# Altium project Omnifly-H7.PrjPcb (part 1 of 2)
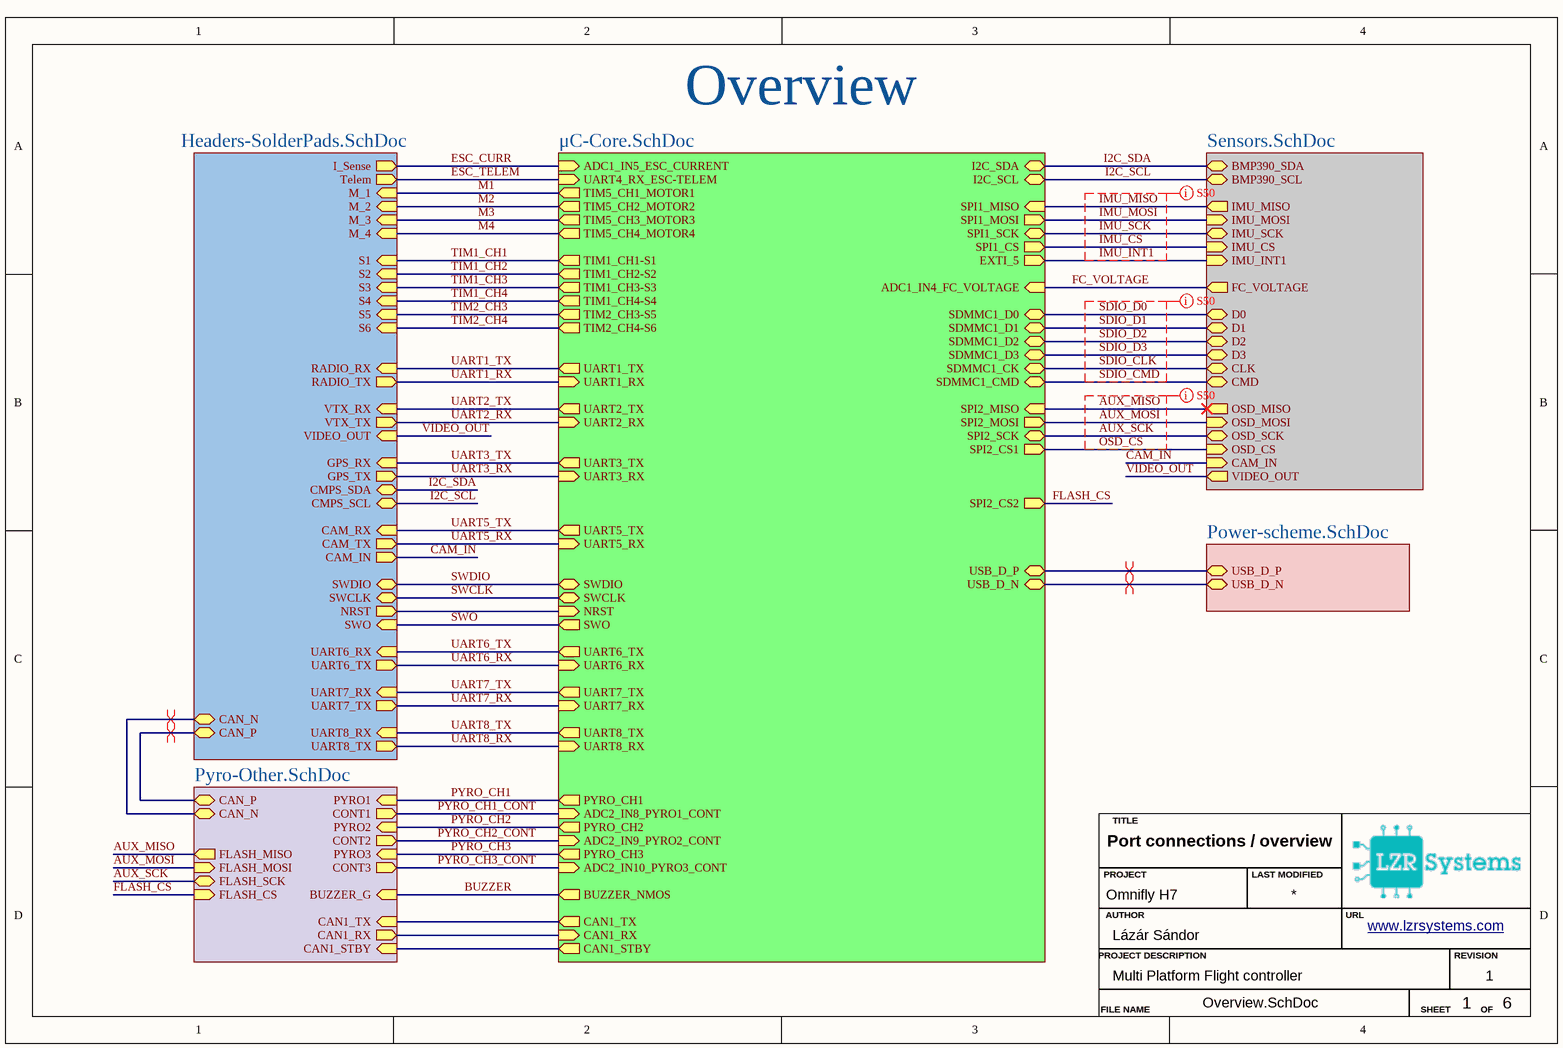
[diagram p0: Overview.SchDoc]
G.Author: Lázár Sándor; G.Description: Multi Platform Flight controller; G.Project: Omnifly H7; G.Revision: 1; G.URL: www.lzrsystems.com
6 sheets, 175 parts. Net scope: hierarchical (ports join the sheet entries above them; power ports are global).
Board file: PCB1.PcbDoc
Sheets:
  Overview.SchDoc
    U_μC-Core = μC-Core.SchDoc
    U_Headers-SolderPads = Headers-SolderPads.SchDoc
    U_Sensors = Sensors.SchDoc
    U_Pyro-Other = Pyro-Other.SchDoc
    U_Power-scheme = Power-scheme.SchDoc

## Sheet Overview.SchDoc: Port connections / overview
size A4; SheetNumber: 1; SheetTotal: 6

### Sub-sheets
U_Headers-SolderPads = Headers-SolderPads.SchDoc: I_Sense (out), M_2 (in), M_3 (in), M_4 (in), Telem (out), M_1 (in), S1 (in), S2 (in), S3 (in), S4 (in), S5 (in), S6 (in), GPS_TX (out), CMPS_SDA (bidir), CMPS_SCL (bidir), CAM_RX (in), CAM_TX (out), CAM_IN (out), SWDIO (bidir), SWCLK (bidir), SWO (in), GPS_RX (in), RADIO_TX (out), RADIO_RX (in), VTX_TX (out), VTX_RX (in), VIDEO_OUT (in), NRST (out), UART6_TX (out), UART6_RX (in), UART7_TX (out), UART7_RX (in), UART8_TX (out), UART8_RX (in), CAN_P (bidir), CAN_N (bidir)
U_Power-scheme = Power-scheme.SchDoc: USB_D_P (bidir), USB_D_N (bidir)
U_Pyro-Other = Pyro-Other.SchDoc: PYRO1 (in), CONT1 (out), PYRO2 (in), PYRO3 (in), CONT2 (out), CONT3 (out), BUZZER_G (in), CAN1_RX (out), CAN1_TX (in), CAN1_STBY (in), CAN_P (bidir), CAN_N (bidir), FLASH_MISO (out), FLASH_MOSI (in), FLASH_SCK (bidir), FLASH_CS (in)
U_Sensors = Sensors.SchDoc: BMP390_SCL (bidir), BMP390_SDA (bidir), IMU_CS (in), IMU_INT1 (in), IMU_SCK (bidir), IMU_MISO (out), IMU_MOSI (in), FC_VOLTAGE (out), D3 (bidir), D2 (bidir), CMD (bidir), CLK (bidir), D0 (bidir), D1 (bidir), OSD_CS (in), OSD_MOSI (in), OSD_MISO (out), OSD_SCK (bidir), VIDEO_OUT (out), CAM_IN (in)
U_μC-Core = μC-Core.SchDoc: SWDIO (bidir), SWCLK (bidir), SWO (out), SPI1_CS (out), SPI1_SCK (bidir), SPI1_MISO (in), SPI1_MOSI (out), SPI2_SCK (bidir), SPI2_MOSI (out), SPI2_MISO (in), SDMMC1_CMD (bidir), SDMMC1_CK (bidir), SDMMC1_D3 (bidir), SDMMC1_D2 (bidir), SDMMC1_D1 (bidir), SDMMC1_D0 (bidir), PYRO_CH3 (out), PYRO_CH2 (out), PYRO_CH1 (out), ADC1_IN4_FC_VOLTAGE (in), ADC1_IN5_ESC_CURRENT (in), TIM5_CH1_MOTOR1 (out), TIM5_CH2_MOTOR2 (out), TIM5_CH3_MOTOR3 (out), TIM5_CH4_MOTOR4 (out), UART4_RX_ESC-TELEM (in), BUZZER_NMOS (out), USB_D_P (bidir), USB_D_N (bidir), UART1_TX (out), UART1_RX (in), UART2_TX (out), UART2_RX (in), UART3_TX (out), UART3_RX (in), UART5_TX (out), UART5_RX (in), UART6_TX (out), UART6_RX (in), UART7_TX (out), UART7_RX (in), UART8_TX (out), UART8_RX (in), TIM2_CH3-S5 (out), TIM2_CH4-S6 (out), TIM1_CH1-S1 (out), TIM1_CH2-S2 (out), TIM1_CH3-S3 (out), TIM1_CH4-S4 (out), I2C_SCL (bidir), I2C_SDA (bidir), EXTI_5 (out), NRST (in), ADC2_IN8_PYRO1_CONT (in), ADC2_IN9_PYRO2_CONT (in), ADC2_IN10_PYRO3_CONT (in), CAN1_STBY (out), CAN1_RX (in), CAN1_TX (out), SPI2_CS1 (out), SPI2_CS2 (out)

### Nets
AUX_MISO: sheet U_μC-Core/SPI2_MISO, sheet U_Sensors/OSD_MISO, sheet U_Pyro-Other/FLASH_MISO
AUX_MOSI: sheet U_μC-Core/SPI2_MOSI, sheet U_Sensors/OSD_MOSI, sheet U_Pyro-Other/FLASH_MOSI
AUX_SCK: sheet U_μC-Core/SPI2_SCK, sheet U_Sensors/OSD_SCK, sheet U_Pyro-Other/FLASH_SCK
BUZZER: sheet U_μC-Core/BUZZER_NMOS, sheet U_Pyro-Other/BUZZER_G
CAM_IN: sheet U_Headers-SolderPads/CAM_IN, sheet U_Sensors/CAM_IN
CAN_N: sheet U_Headers-SolderPads/CAN_N, sheet U_Pyro-Other/CAN_N
CAN_P: sheet U_Headers-SolderPads/CAN_P, sheet U_Pyro-Other/CAN_P
ESC_CURR: sheet U_μC-Core/ADC1_IN5_ESC_CURRENT, sheet U_Headers-SolderPads/I_Sense
ESC_TELEM: sheet U_μC-Core/UART4_RX_ESC-TELEM, sheet U_Headers-SolderPads/Telem
FC_VOLTAGE: sheet U_μC-Core/ADC1_IN4_FC_VOLTAGE, sheet U_Sensors/FC_VOLTAGE
FLASH_CS: sheet U_μC-Core/SPI2_CS2, sheet U_Pyro-Other/FLASH_CS
I2C_SCL: sheet U_μC-Core/I2C_SCL, sheet U_Headers-SolderPads/CMPS_SCL, sheet U_Sensors/BMP390_SCL
I2C_SDA: sheet U_μC-Core/I2C_SDA, sheet U_Headers-SolderPads/CMPS_SDA, sheet U_Sensors/BMP390_SDA
IMU_CS: sheet U_μC-Core/SPI1_CS, sheet U_Sensors/IMU_CS
IMU_INT1: sheet U_μC-Core/EXTI_5, sheet U_Sensors/IMU_INT1
IMU_MISO: sheet U_μC-Core/SPI1_MISO, sheet U_Sensors/IMU_MISO
IMU_MOSI: sheet U_μC-Core/SPI1_MOSI, sheet U_Sensors/IMU_MOSI
IMU_SCK: sheet U_μC-Core/SPI1_SCK, sheet U_Sensors/IMU_SCK
M1: sheet U_μC-Core/TIM5_CH1_MOTOR1, sheet U_Headers-SolderPads/M_1
M2: sheet U_μC-Core/TIM5_CH2_MOTOR2, sheet U_Headers-SolderPads/M_2
M3: sheet U_μC-Core/TIM5_CH3_MOTOR3, sheet U_Headers-SolderPads/M_3
M4: sheet U_μC-Core/TIM5_CH4_MOTOR4, sheet U_Headers-SolderPads/M_4
NRST: sheet U_μC-Core/NRST, sheet U_Headers-SolderPads/NRST
OSD_CS: sheet U_μC-Core/SPI2_CS1, sheet U_Sensors/OSD_CS
PYRO_CH1: sheet U_μC-Core/PYRO_CH1, sheet U_Pyro-Other/PYRO1
PYRO_CH1_CONT: sheet U_μC-Core/ADC2_IN8_PYRO1_CONT, sheet U_Pyro-Other/CONT1
PYRO_CH2: sheet U_μC-Core/PYRO_CH2, sheet U_Pyro-Other/PYRO2
PYRO_CH2_CONT: sheet U_μC-Core/ADC2_IN9_PYRO2_CONT, sheet U_Pyro-Other/CONT2
PYRO_CH3: sheet U_μC-Core/PYRO_CH3, sheet U_Pyro-Other/PYRO3
PYRO_CH3_CONT: sheet U_μC-Core/ADC2_IN10_PYRO3_CONT, sheet U_Pyro-Other/CONT3
SDIO_CLK: sheet U_μC-Core/SDMMC1_CK, sheet U_Sensors/CLK
SDIO_CMD: sheet U_μC-Core/SDMMC1_CMD, sheet U_Sensors/CMD
SDIO_D0: sheet U_μC-Core/SDMMC1_D0, sheet U_Sensors/D0
SDIO_D1: sheet U_μC-Core/SDMMC1_D1, sheet U_Sensors/D1
SDIO_D2: sheet U_μC-Core/SDMMC1_D2, sheet U_Sensors/D2
SDIO_D3: sheet U_μC-Core/SDMMC1_D3, sheet U_Sensors/D3
SWCLK: sheet U_μC-Core/SWCLK, sheet U_Headers-SolderPads/SWCLK
SWDIO: sheet U_μC-Core/SWDIO, sheet U_Headers-SolderPads/SWDIO
SWO: sheet U_μC-Core/SWO, sheet U_Headers-SolderPads/SWO
TIM1_CH1: sheet U_μC-Core/TIM1_CH1-S1, sheet U_Headers-SolderPads/S1
TIM1_CH2: sheet U_μC-Core/TIM1_CH2-S2, sheet U_Headers-SolderPads/S2
TIM1_CH3: sheet U_μC-Core/TIM1_CH3-S3, sheet U_Headers-SolderPads/S3
TIM1_CH4: sheet U_μC-Core/TIM1_CH4-S4, sheet U_Headers-SolderPads/S4
TIM2_CH3: sheet U_μC-Core/TIM2_CH3-S5, sheet U_Headers-SolderPads/S5
TIM2_CH4: sheet U_μC-Core/TIM2_CH4-S6, sheet U_Headers-SolderPads/S6
UART1_RX: sheet U_μC-Core/UART1_RX, sheet U_Headers-SolderPads/RADIO_TX
UART1_TX: sheet U_μC-Core/UART1_TX, sheet U_Headers-SolderPads/RADIO_RX
UART2_RX: sheet U_μC-Core/UART2_RX, sheet U_Headers-SolderPads/VTX_TX
UART2_TX: sheet U_μC-Core/UART2_TX, sheet U_Headers-SolderPads/VTX_RX
UART3_RX: sheet U_μC-Core/UART3_RX, sheet U_Headers-SolderPads/GPS_TX
UART3_TX: sheet U_μC-Core/UART3_TX, sheet U_Headers-SolderPads/GPS_RX
UART5_RX: sheet U_μC-Core/UART5_RX, sheet U_Headers-SolderPads/CAM_TX
UART5_TX: sheet U_μC-Core/UART5_TX, sheet U_Headers-SolderPads/CAM_RX
UART6_RX: sheet U_μC-Core/UART6_RX, sheet U_Headers-SolderPads/UART6_TX
UART6_TX: sheet U_μC-Core/UART6_TX, sheet U_Headers-SolderPads/UART6_RX
UART7_RX: sheet U_μC-Core/UART7_RX, sheet U_Headers-SolderPads/UART7_TX
UART7_TX: sheet U_μC-Core/UART7_TX, sheet U_Headers-SolderPads/UART7_RX
UART8_RX: sheet U_μC-Core/UART8_RX, sheet U_Headers-SolderPads/UART8_TX
UART8_TX: sheet U_μC-Core/UART8_TX, sheet U_Headers-SolderPads/UART8_RX
USB_D_N: sheet U_μC-Core/USB_D_N, sheet U_Power-scheme/USB_D_N
USB_D_P: sheet U_μC-Core/USB_D_P, sheet U_Power-scheme/USB_D_P
VIDEO_OUT: sheet U_Headers-SolderPads/VIDEO_OUT, sheet U_Sensors/VIDEO_OUT
NetU3_1: sheet U_μC-Core/CAN1_STBY, sheet U_Pyro-Other/CAN1_STBY
NetU3_95: sheet U_μC-Core/CAN1_RX, sheet U_Pyro-Other/CAN1_RX
NetU3_96: sheet U_μC-Core/CAN1_TX, sheet U_Pyro-Other/CAN1_TX

### Layout directives
differential pair: CAN_N, CAN_P, USB_D_N, USB_D_P
net class S50: AUX_MISO, AUX_MOSI, AUX_SCK, IMU_CS, IMU_INT1, IMU_MISO, IMU_MOSI, IMU_SCK, OSD_CS, SDIO_CLK, SDIO_CMD, SDIO_D0, SDIO_D1, SDIO_D2, SDIO_D3

### Notes on the sheet
- Overview
- TITLE
- AUTHOR
- PROJECT
- LAST MODIFIED
- URL
- PROJECT DESCRIPTION
- REVISION
- FILE NAME
- SHEET
- OF

## Sheet μC-Core.SchDoc: Microcontroller & Pinout
size A4; Author: Lázár Sándor; SheetNumber: 3; SheetTotal: 6; URL: lzrsystems.com
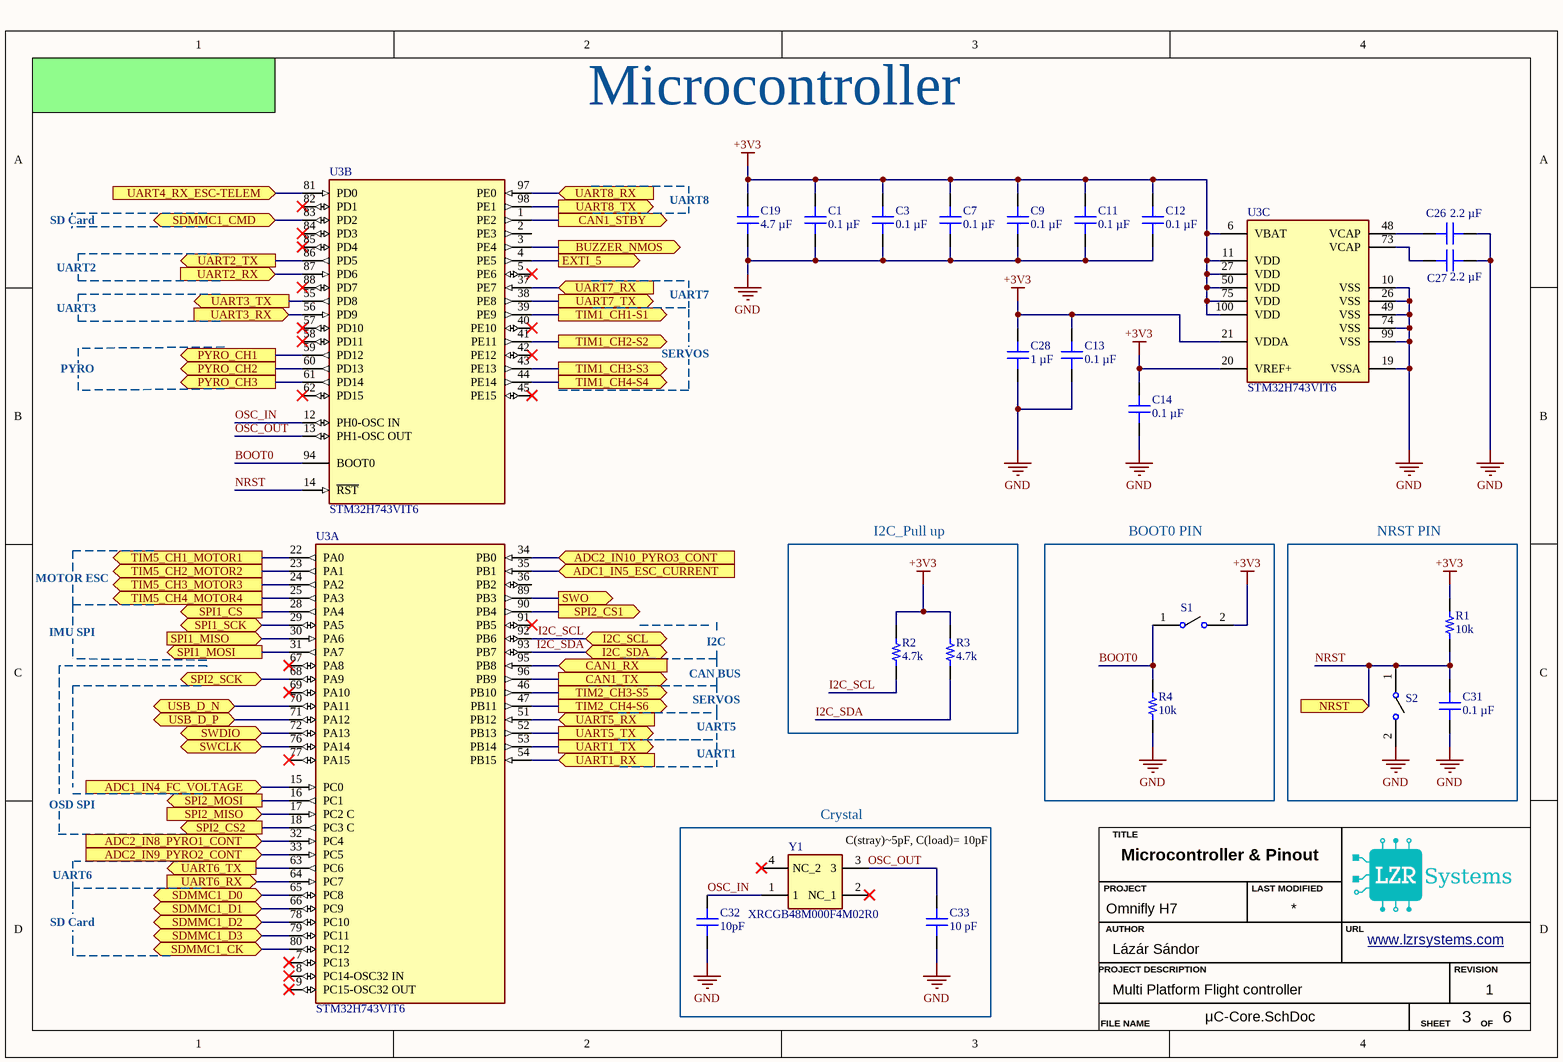
[diagram p1: μC-Core.SchDoc]

### Parts
C1  0.1 µF  [MURATA GCM155 0402_1005]
C3  0.1 µF  [MURATA GCM155 0402_1005]
C7  0.1 µF  [MURATA GCM155 0402_1005]
C9  0.1 µF  [MURATA GCM155 0402_1005]
C11  0.1 µF  [MURATA GCM155 0402_1005]
C12  0.1 µF  [MURATA GCM155 0402_1005]
C13  0.1 µF  [MURATA GCM155 0402_1005]
C14  0.1 µF  [MURATA GCM155 0402_1005]
C19  4.7 µF  [MURATA GRM21B 0805_2012]
C26  2.2 µF  [CAP 0805_2012]
C27  2.2 µF  [CAP 0805_2012]
C28  1 µF  [CAP 0805_2012]
C31  0.1 µF  [MURATA GCM155 0402_1005]
C32  Capacitance: 10pF  [CAP 0402_1005]  (hidden comment: 10 pF)
C33  10 pF  [CAP 0402_1005]
R1  10k  [YAGEO RES 0402_1005]
R2  4.7k  [YAGEO RES 0402_1005]
R3  4.7k  [YAGEO RES 0402_1005]
R4  10k  [YAGEO RES 0402_1005]
S1  TS09-63-25-WT-160-SMT-TR  [TS096325WT160SMTTR]  (value not drawn)
S2  TS09-63-25-WT-160-SMT-TR  [TS096325WT160SMTTR]  (value not drawn)
U3  STM32H743VIT6  [FP-LQFP100-1L-IPC_C]  (parts A,B,C of 3)
Y1  XRCGB48M000F4M02R0  [XRCGB]

### Blocks framed on the sheet
I2C_Pull up: R2 R3
BOOT0 PIN: R4 S1
NRST PIN: C31 R1 S2
Crystal: C32 C33 Y1

### Ports
ADC1_IN4_FC_VOLTAGE (in), ADC1_IN5_ESC_CURRENT (in), ADC2_IN8_PYRO1_CONT (in), ADC2_IN9_PYRO2_CONT (in), ADC2_IN10_PYRO3_CONT (in), BUZZER_NMOS (out), CAN1_RX (in), CAN1_STBY (out), CAN1_TX (out), EXTI_5 (out), I2C_SCL (bidir), I2C_SDA (bidir), NRST (in), PYRO_CH1 (out), PYRO_CH2 (out), PYRO_CH3 (out), SDMMC1_CK (bidir), SDMMC1_CMD (bidir), SDMMC1_D0 (bidir), SDMMC1_D1 (bidir), SDMMC1_D2 (bidir), SDMMC1_D3 (bidir), SPI1_CS (out), SPI1_MISO (in), SPI1_MOSI (out), SPI1_SCK (bidir), SPI2_CS1 (out), SPI2_CS2 (out), SPI2_MISO (in), SPI2_MOSI (out), SPI2_SCK (bidir), SWCLK (bidir), SWDIO (bidir), SWO (out), TIM1_CH1-S1 (out), TIM1_CH2-S2 (out), TIM1_CH3-S3 (out), TIM1_CH4-S4 (out), TIM2_CH3-S5 (out), TIM2_CH4-S6 (out), TIM5_CH1_MOTOR1 (out), TIM5_CH2_MOTOR2 (out), TIM5_CH3_MOTOR3 (out), TIM5_CH4_MOTOR4 (out), UART1_RX (in), UART1_TX (out), UART2_RX (in), UART2_TX (out), UART3_RX (in), UART3_TX (out), UART4_RX_ESC-TELEM (in), UART5_RX (in), UART5_TX (out), UART6_RX (in), UART6_TX (out), UART7_RX (in), UART7_TX (out), UART8_RX (in), UART8_TX (out), USB_D_N (bidir), USB_D_P (bidir)

### Nets
+3V3: C1.2 C3.2 C7.2 C9.2 C11.2 C12.2 C13.2 C14.2 C19.2 C28.2 R1.1 R2.2 R3.2 S1.2(NO) U3.6(VBAT) U3.11(VDD) U3.20(VREF+) U3.21(VDDA) U3.27(VDD) U3.50(VDD) U3.75(VDD) U3.100(VDD)
GND: C1.1 C3.1 C7.1 C9.1 C11.1 C12.1 C13.1 C14.1 C19.1 C26.2 C27.1 C28.1 C31.1 C32.1 C33.1 R4.2 S2.2(NO) U3.10(VSS) U3.19(VSSA) U3.26(VSS) U3.49(VSS) U3.74(VSS) U3.99(VSS)
AUX_MISO: U3.17(PC2_C) ; port SPI2_MISO
AUX_MOSI: U3.16(PC1) ; port SPI2_MOSI
AUX_SCK: U3.68(PA9) ; port SPI2_SCK
BOOT0: R4.1 S1.1(COM) U3.94(BOOT0)
BUZZER: U3.3(PE4) ; port BUZZER_NMOS
ESC_CURR: U3.35(PB1) ; port ADC1_IN5_ESC_CURRENT
ESC_TELEM: U3.81(PD0) ; port UART4_RX_ESC-TELEM
FC_VOLTAGE: U3.15(PC0) ; port ADC1_IN4_FC_VOLTAGE
FLASH_CS: U3.18(PC3_C) ; port SPI2_CS2
I2C_SCL: R2.1 U3.92(PB6) ; port I2C_SCL
I2C_SDA: R3.1 U3.93(PB7) ; port I2C_SDA
IMU_CS: U3.28(PA4) ; port SPI1_CS
IMU_INT1: U3.4(PE5) ; port EXTI_5
IMU_MISO: U3.30(PA6) ; port SPI1_MISO
IMU_MOSI: U3.31(PA7) ; port SPI1_MOSI
IMU_SCK: U3.29(PA5) ; port SPI1_SCK
M1: U3.22(PA0) ; port TIM5_CH1_MOTOR1
M2: U3.23(PA1) ; port TIM5_CH2_MOTOR2
M3: U3.24(PA2) ; port TIM5_CH3_MOTOR3
M4: U3.25(PA3) ; port TIM5_CH4_MOTOR4
NRST: C31.2 R1.2 S2.1(COM) U3.14(~{RST}) ; port NRST
OSC_IN: C32.2 U3.12(PH0-OSC_IN) Y1.1
OSC_OUT: C33.2 U3.13(PH1-OSC_OUT) Y1.3
OSD_CS: U3.90(PB4) ; port SPI2_CS1
PYRO_CH1: U3.59(PD12) ; port PYRO_CH1
PYRO_CH1_CONT: U3.32(PC4) ; port ADC2_IN8_PYRO1_CONT
PYRO_CH2: U3.60(PD13) ; port PYRO_CH2
PYRO_CH2_CONT: U3.33(PC5) ; port ADC2_IN9_PYRO2_CONT
PYRO_CH3: U3.61(PD14) ; port PYRO_CH3
PYRO_CH3_CONT: U3.34(PB0) ; port ADC2_IN10_PYRO3_CONT
SDIO_CLK: U3.80(PC12) ; port SDMMC1_CK
SDIO_CMD: U3.83(PD2) ; port SDMMC1_CMD
SDIO_D0: U3.65(PC8) ; port SDMMC1_D0
SDIO_D1: U3.66(PC9) ; port SDMMC1_D1
SDIO_D2: U3.78(PC10) ; port SDMMC1_D2
SDIO_D3: U3.79(PC11) ; port SDMMC1_D3
SWCLK: U3.76(PA14) ; port SWCLK
SWDIO: U3.72(PA13) ; port SWDIO
SWO: U3.89(PB3) ; port SWO
TIM1_CH1: U3.39(PE9) ; port TIM1_CH1-S1
TIM1_CH2: U3.41(PE11) ; port TIM1_CH2-S2
TIM1_CH3: U3.43(PE13) ; port TIM1_CH3-S3
TIM1_CH4: U3.44(PE14) ; port TIM1_CH4-S4
TIM2_CH3: U3.46(PB10) ; port TIM2_CH3-S5
TIM2_CH4: U3.47(PB11) ; port TIM2_CH4-S6
UART1_RX: U3.54(PB15) ; port UART1_RX
UART1_TX: U3.53(PB14) ; port UART1_TX
UART2_RX: U3.87(PD6) ; port UART2_RX
UART2_TX: U3.86(PD5) ; port UART2_TX
UART3_RX: U3.56(PD9) ; port UART3_RX
UART3_TX: U3.55(PD8) ; port UART3_TX
UART5_RX: U3.51(PB12) ; port UART5_RX
UART5_TX: U3.52(PB13) ; port UART5_TX
UART6_RX: U3.64(PC7) ; port UART6_RX
UART6_TX: U3.63(PC6) ; port UART6_TX
UART7_RX: U3.37(PE7) ; port UART7_RX
UART7_TX: U3.38(PE8) ; port UART7_TX
UART8_RX: U3.97(PE0) ; port UART8_RX
UART8_TX: U3.98(PE1) ; port UART8_TX
USB_D_N: U3.70(PA11) ; port USB_D_N
USB_D_P: U3.71(PA12) ; port USB_D_P
NetC26_1: C26.1 U3.48(VCAP)
NetC27_2: C27.2 U3.73(VCAP)
NetU3_1: U3.1(PE2) ; port CAN1_STBY
NetU3_95: U3.95(PB8) ; port CAN1_RX
NetU3_96: U3.96(PB9) ; port CAN1_TX

Not connected (* = marked no-connect by the designer): U3 2(PE3) 5(PE6)* 7(PC13)* 8(PC14-OSC32_IN)* 9(PC15-OSC32_OUT)* 36(PB2) 40(PE10)* 42(PE12)* 45(PE15)* 57(PD10)* 58(PD11)* 62(PD15)* 67(PA8)* 69(PA10)* 77(PA15)* 82(PD1)* 84(PD3)* 85(PD4)* 88(PD7)* 91(PB5)*; Y1 2(NC_1)* 4(NC_2)*

### Notes on the sheet
- Microcontroller
- (near C19) UART8
- SD Card
- UART2
- UART3
- UART7
- PYRO
- SERVOS
- MOTOR ESC
- IMU SPI
- CAN BUS
- I2C
- UART5
- OSD SPI
- UART1
- UART6
- (near Y1) C(stray)~5pF, C(load)= 10pF
- TITLE
- AUTHOR
- PROJECT
- LAST MODIFIED
- URL
- PROJECT DESCRIPTION
- REVISION
- FILE NAME
- SHEET
- OF

### Library data of the parts
C1 C3 C7 C9 C11-C14 C31 = GCM155R71H104ME02D: CAP CER 0.1UF 50V X7R 0402; manufacturer: Murata Electronics; Tolerance: ±20%; Part Number: GCM155R71H104ME02D; Capacitance: 0.1 µF; Applications: Automotive; componentlink1description: Datasheet; componentlink1url: https://psearch.en.murata.com/capacitor/product/GCM155R71H104ME02%23.pdf; componentlink2description: DigiKey Link; componentlink2url: https://www.digikey.com/en/products/detail/murata-electronics/GCM155R71H104ME02D/9867913; Device Package: 0402 (1005 Metric); lastupdated: 7/20/2024 2:04:19 AM; Lifecycle Status: Active; Minimum Order: 1; Mounting Type: Surface Mount, MLCC; Operating Temperature: -55°C ~ 125°C; Package / Case: 0402 (1005 Metric); packaging: TapeAndReel; partid: 39038; Part Status: Active; price: 0.01; Ratings: AEC-Q200; series: GCM; Size / Dimension: 0.039" L x 0.020" W (1.00mm x 0.50mm); Supplier 1: DigiKey; Supplier Part Number 1: 490-18204-1-ND; Temperature Coefficient: X7R; Thickness (Max): 0.022" (0.55mm); value: 0.1 µF; Voltage - Rated: 50V
C19 = GRM21BR61H475KE51L: CAP CER 4.7UF 50V X5R 0805; manufacturer: Murata Electronics; Tolerance: ±10%; Part Number: GRM21BR61H475KE51L; Capacitance: 4.7 µF; Applications: General Purpose; componentlink1description: Datasheet; componentlink1url: https://search.murata.co.jp/Ceramy/image/img/A01X/G101/ENG/GRM21BR61H475KE51-01.pdf; componentlink2description: DigiKey Link; componentlink2url: https://www.digikey.com/en/products/detail/murata-electronics/GRM21BR61H475KE51L/4905540; Device Package: 0805 (2012 Metric); lastupdated: 8/27/2024 9:29:55 AM; Lifecycle Status: Active; Minimum Order: 1; Mounting Type: Surface Mount, MLCC; Operating Temperature: -55°C ~ 85°C; Package / Case: 0805 (2012 Metric); packaging: TapeAndReel; partid: 15077; Part Status: Active; price: 0.03; series: GRM; Size / Dimension: 0.079" L x 0.049" W (2.00mm x 1.25mm); Supplier 1: DigiKey; Supplier Part Number 1: 490-10751-1-ND; Temperature Coefficient: X5R; Thickness (Max): 0.055" (1.40mm); value: 4.7 µF; Voltage - Rated: 50V
C26 C27 = GCM21BL8EG225KE07L: CAP CER 2.2UF 35V X8L 0805; manufacturer: Murata Electronics; Tolerance: ±10%; Part Number: GCM21BL8EG225KE07L; Capacitance: 2.2 µF; Applications: Automotive; componentlink2description: DigiKey Link; componentlink2url: https://www.digikey.com/en/products/detail/murata-electronics/GCM21BL8EG225KE07L/10700975; Device Package: 0805 (2012 Metric); lastupdated: 2/9/2024 8:15:05 PM; Lifecycle Status: Active; Minimum Order: 1; Mounting Type: Surface Mount, MLCC; Operating Temperature: -55°C ~ 150°C; Package / Case: 0805 (2012 Metric); packaging: TapeAndReel; partid: 40665; Part Status: Active; price: 0.10; Ratings: AEC-Q200; series: GCM; Size / Dimension: 0.079" L x 0.049" W (2.00mm x 1.25mm); Supplier 1: DigiKey; Supplier Part Number 1: 490-GCM21BL8EG225KE07LCT-ND; Temperature Coefficient: X8L; Thickness (Max): 0.055" (1.40mm); value: 2.2 µF; Voltage - Rated: 35V
C28 = GRM219R7YA105MA12D: CAP CER 1UF 35V X7R 0805; manufacturer: Murata Electronics; Tolerance: ±20%; Part Number: GRM219R7YA105MA12D; Capacitance: 1 µF; Applications: General Purpose; componentlink1description: Datasheet; componentlink1url: https://search.murata.co.jp/Ceramy/image/img/A01X/G101/ENG/GRM219R7YA105MA12-01.pdf; componentlink2description: DigiKey Link; componentlink2url: https://www.digikey.com/en/products/detail/murata-electronics/GRM219R7YA105MA12D/5027580; Device Package: 0805 (2012 Metric); lastupdated: 2/9/2024 8:15:57 PM; Lifecycle Status: Active; Minimum Order: 1; Mounting Type: Surface Mount, MLCC; Operating Temperature: -55°C ~ 125°C; Package / Case: 0805 (2012 Metric); packaging: TapeAndReel; partid: 6744; Part Status: Active; price: 0.02; series: GRM; Size / Dimension: 0.079" L x 0.049" W (2.00mm x 1.25mm); Supplier 1: DigiKey; Supplier Part Number 1: 490-10495-1-ND; Temperature Coefficient: X7R; Thickness (Max): 0.037" (0.95mm); value: 1 µF; Voltage - Rated: 35V
C32 C33 = C0402C100K4GAC7867: CAP CER 10PF 16V C0G/NP0 0402; manufacturer: KEMET; Temperature Coefficient: C0G, NP0; Tolerance: ±10%; Part Number: C0402C100K4GAC7867; Applications: General Purpose; componentlink1description: Datasheet; componentlink1url: https://api.kemet.com/component-edge/download/datasheet/C0402C100K4GACTU.pdf; componentlink2description: DigiKey Link; componentlink2url: https://www.digikey.com/en/products/detail/kemet/C0402C100K4GAC7867/2196156; Device Package: 0402 (1005 Metric); Features: Low ESL; lastupdated: 2/9/2024 8:04:15 PM; Lifecycle Status: Active; Minimum Order: 1; Mounting Type: Surface Mount, MLCC; Operating Temperature: -55°C ~ 125°C; Package / Case: 0402 (1005 Metric); packaging: TapeAndReel; partid: 33741; Part Status: Active; price: 0.05; series: SMD Comm C0G; Size / Dimension: 0.039" L x 0.020" W (1.00mm x 0.50mm); Supplier 1: DigiKey; Supplier Part Number 1: 399-C0402C100K4GAC7867CT-ND; Thickness (Max): 0.022" (0.55mm); value: 10 pF; Voltage - Rated: 16V
  C33: Capacitance: 10 pF
R1 R4 = AC0402DR-0710KL: RES 10K OHM 0.5% 1/16W 0402; Manufacturer: Yageo; Power (Watts): 0.063W, 1/16W; Resistance: 10 kOhms; Temperature Coefficient: ±100ppm/°C; Part Number: AC0402DR-0710KL; Value: 10k; ComponentLink1Description: Datasheet; ComponentLink1URL: https://www.yageo.com/upload/media/product/productsearch/datasheet/rchip/PYu-AC_51_RoHS_L_9.pdf; ComponentLink2Description: DigiKey Link; ComponentLink2URL: https://www.digikey.com/en/products/detail/yageo/AC0402DR-0710KL/16990352; Composition: Thick Film; Device Package: 0402 (1005 Metric); Features: Automotive AEC-Q200, Moisture Resistant; Height - Seated (Max): 0.015" (0.37mm); LastUpdated: 8/31/2025 3:03:41 PM; Lifecycle Status: Active; Minimum Order: 1; Number of Terminations: 2; Operating Temperature: -55°C ~ 155°C; Package / Case: 0402 (1005 Metric); Packaging: TapeAndReel; PartId: 77661; Part Status: Active; Price: 0.01; Ratings: AEC-Q200; Series: AC; Size / Dimension: 0.039" L x 0.020" W (1.00mm x 0.50mm); Supplier 1: DigiKey; Supplier Part Number 1: 13-AC0402DR-0710KLCT-ND; Supplier Device Package: 0402; Tolerance: ±0.5%
R2 R3 = AC0402FR-134K7L: RES 4.7K OHM 1% 1/16W 0402; Manufacturer: Yageo; Power (Watts): 0.063W, 1/16W; Resistance: 4.7 kOhms; Temperature Coefficient: ±100ppm/°C; Part Number: AC0402FR-134K7L; Value: 4.7k; ComponentLink1Description: Datasheet; ComponentLink1URL: https://www.yageo.com/upload/media/product/productsearch/datasheet/rchip/PYu-AC_51_RoHS_L_8.pdf; ComponentLink2Description: DigiKey Link; ComponentLink2URL: https://www.digikey.com/en/products/detail/yageo/AC0402FR-134K7L/14008367; Composition: Thick Film; Device Package: 0402 (1005 Metric); Height - Seated (Max): 0.015" (0.37mm); LastUpdated: 8/31/2025 3:03:54 PM; Lifecycle Status: Active; Minimum Order: 1; Number of Terminations: 2; Operating Temperature: -55°C ~ 155°C; Package / Case: 0402 (1005 Metric); Packaging: CutTape; PartId: 65258; Part Status: Active; Price: 0.01; Ratings: AEC-Q200; Series: AC; Size / Dimension: 0.039" L x 0.020" W (1.00mm x 0.50mm); Supplier 1: DigiKey; Supplier Part Number 1: 13-AC0402FR-134K7LCT-ND; Supplier Device Package: 0402; Tolerance: ±1%
S1 S2 = TS09-63-25-WT-160-SMT-TR: Switch; Manufacturer_Name: Same Sky; Datasheet Link: https://www.sameskydevices.com/product/resource/ts09.pdf; Height: 2.7mm; Manufacturer_Part_Number: TS09-63-25-WT-160-SMT-TR; Mouser Part Number: 179-TS0925WT160SMTTR; Mouser Price/Stock: https://www.mouser.co.uk/ProductDetail/CUI-Devices/TS09-63-25-WT-160-SMT-TR?qs=Rp5uXu7WBW%2F4oc%2FgdKTFnw%3D%3D
U3 = CMP-020-00029-1: RISC Microcontroller, 32-Bit, FLASH, CORTEX-M7 CPU, 480MHz, CMOS, PQFP100; Min Supply Voltage: 1.71V; Max Supply Voltage: 3.6V; Interface: Ethernet, I2C, I2S, IrDA, LIN, SPI, UART, USART, USB; RAM Size: 1MB; Max Operating Temperature: 85°C; Min Operating Temperature: -40°C; Frequency: 480MHz
Y1 = XRCGB48M000F4M00R0: Crystal or Oscillator; Manufacturer_Name: Murata Electronics; Datasheet Link: https://www.murata.com/products/productdata/8801067466782/SPEC-XRCGB48M000F4M00R0.pdf; Height: 0.7mm; Manufacturer_Part_Number: XRCGB48M000F4M00R0; Mouser Part Number: 81-XRCGB48M000F4M0R0; Mouser Price/Stock: https://www.mouser.co.uk/ProductDetail/Murata-Electronics/XRCGB48M000F4M00R0?qs=e%252BE4OD6MgMd07skQ7eZ%2F7Q%3D%3D; Arrow Part Number: XRCGB48M000F4M00R0; Arrow Price/Stock: https://www.arrow.com/en/products/xrcgb48m000f4m00r0/murata-manufacturing

## Sheet Headers-SolderPads.SchDoc: Headers / Solder pads
size A4; Author: Lázár Sándor; SheetNumber: 5; SheetTotal: 6; URL: lzrsystems.com
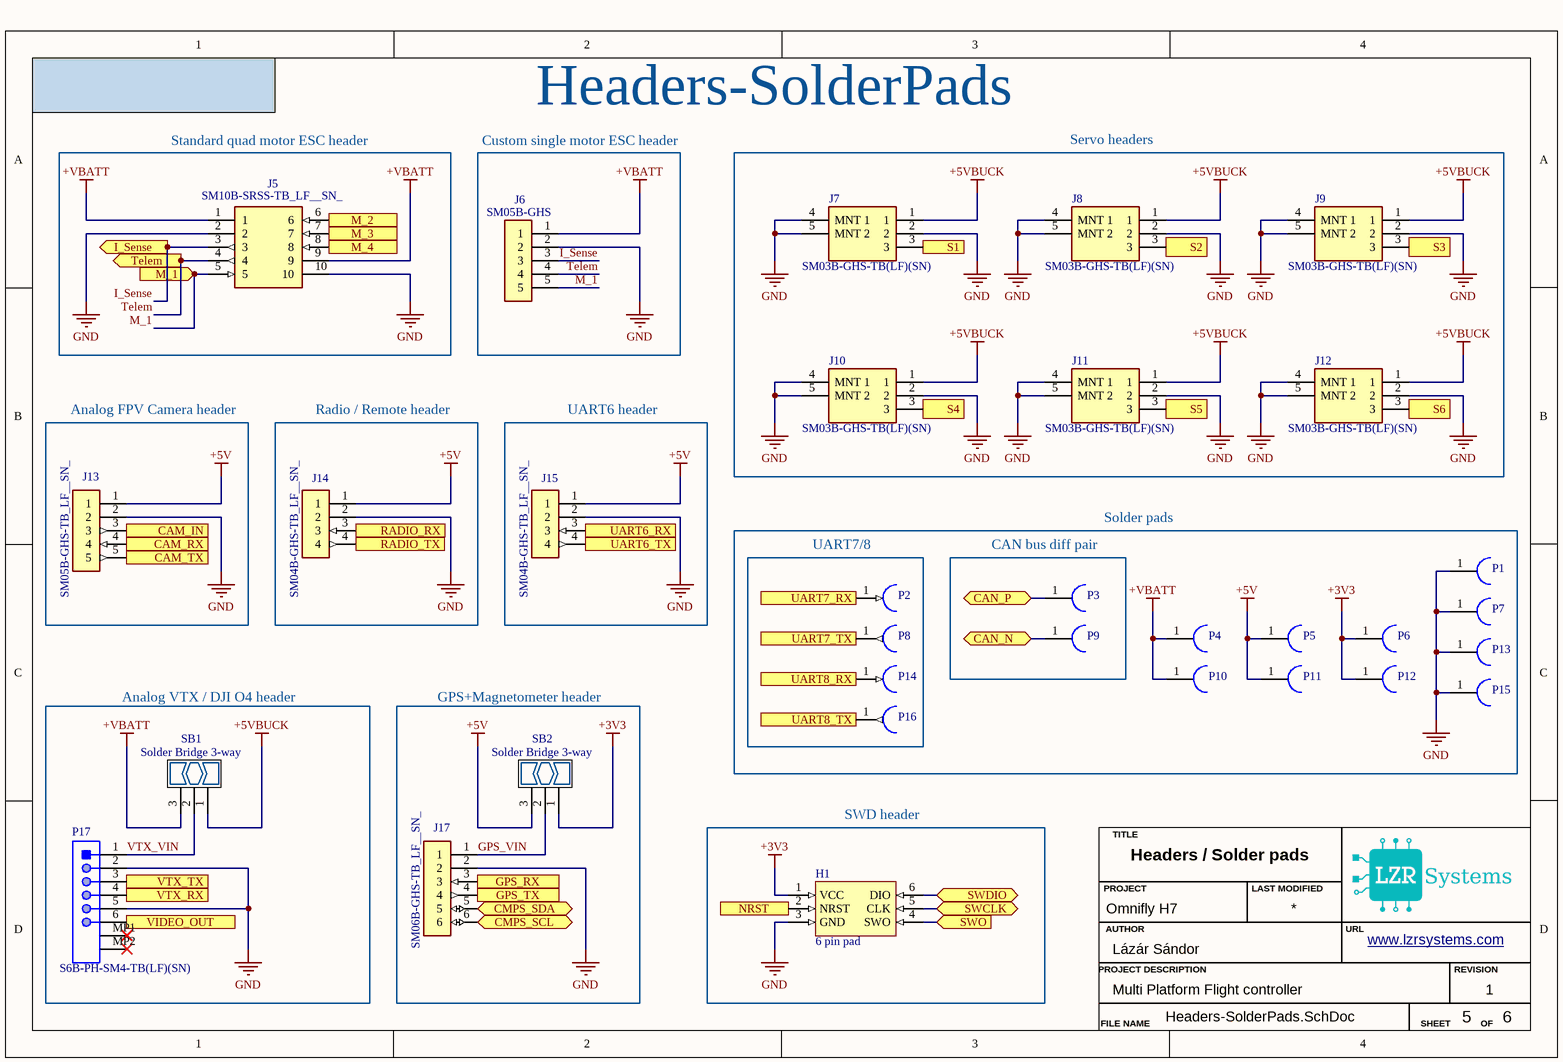
[diagram p2: Headers-SolderPads.SchDoc]

### Parts
H1  6 pin pad  [6 pin pad-Footprint-1]
J5  SM10B-SRSS-TB_LF__SN_  [SM10B-SRSS-TB]
J6  SM05B-GHS  [SM05B-GHS-TB]
J7  SM03B-GHS-TB(LF)(SN)  [FP-SM03B-GHS-TB_LF_SN-MFG]
J8  SM03B-GHS-TB(LF)(SN)  [FP-SM03B-GHS-TB_LF_SN-MFG]
J9  SM03B-GHS-TB(LF)(SN)  [FP-SM03B-GHS-TB_LF_SN-MFG]
J10  SM03B-GHS-TB(LF)(SN)  [FP-SM03B-GHS-TB_LF_SN-MFG]
J11  SM03B-GHS-TB(LF)(SN)  [FP-SM03B-GHS-TB_LF_SN-MFG]
J12  SM03B-GHS-TB(LF)(SN)  [FP-SM03B-GHS-TB_LF_SN-MFG]
J13  SM05B-GHS-TB_LF__SN_  [SM05B-GHS-TB]
J14  SM04B-GHS-TB_LF__SN_  [SM04B-GHS-TB]
J15  SM04B-GHS-TB_LF__SN_  [SM04B-GHS-TB]
J17  SM06B-GHS-TB_LF__SN_  [SM06B-GHS-TB]
P1  Solder Pad 2x1.5mm  [Solder Pad 2x1.5mm-Footprint-1]  (value not drawn)
P2  Solder Pad 2x1.5mm  [Solder Pad 2x1.5mm-Footprint-1]  (value not drawn)
P3  Solder Pad 2x1.5mm  [Solder Pad 2x1.5mm-Footprint-1]  (value not drawn)
P4  Solder Pad 2x1.5mm  [Solder Pad 2x1.5mm-Footprint-1]  (value not drawn)
P5  Solder Pad 2x1.5mm  [Solder Pad 2x1.5mm-Footprint-1]  (value not drawn)
P6  Solder Pad 2x1.5mm  [Solder Pad 2x1.5mm-Footprint-1]  (value not drawn)
P7  Solder Pad 2x1.5mm  [Solder Pad 2x1.5mm-Footprint-1]  (value not drawn)
P8  Solder Pad 2x1.5mm  [Solder Pad 2x1.5mm-Footprint-1]  (value not drawn)
P9  Solder Pad 2x1.5mm  [Solder Pad 2x1.5mm-Footprint-1]  (value not drawn)
P10  Solder Pad 2x1.5mm  [Solder Pad 2x1.5mm-Footprint-1]  (value not drawn)
P11  Solder Pad 2x1.5mm  [Solder Pad 2x1.5mm-Footprint-1]  (value not drawn)
P12  Solder Pad 2x1.5mm  [Solder Pad 2x1.5mm-Footprint-1]  (value not drawn)
P13  Solder Pad 2x1.5mm  [Solder Pad 2x1.5mm-Footprint-1]  (value not drawn)
P14  Solder Pad 2x1.5mm  [Solder Pad 2x1.5mm-Footprint-1]  (value not drawn)
P15  Solder Pad 2x1.5mm  [Solder Pad 2x1.5mm-Footprint-1]  (value not drawn)
P16  Solder Pad 2x1.5mm  [Solder Pad 2x1.5mm-Footprint-1]  (value not drawn)
P17  S6B-PH-SM4-TB(LF)(SN)  [JST-S6B-PH-SM4-TB(LF)(SN)_V]
SB1  Solder Bridge 3-way  [Solder Bridge 3-way-Footprint-1]
SB2  Solder Bridge 3-way  [Solder Bridge 3-way-Footprint-1]

### Blocks framed on the sheet
Standard quad motor ESC header: J5
Custom single motor ESC header: J6
Servo headers: J7-J12
Analog FPV Camera header: J13
Radio / Remote header: J14
UART6 header: J15
Solder pads: P1 P4-P7 P10-P13 P15
UART7/8: P2 P8 P14 P16
CAN bus diff pair: P3 P9
Analog VTX / DJI O4 header: P17 SB1
GPS+Magnetometer header: J17 SB2
SWD header: H1

### Ports
CAM_IN (out), CAM_RX (in), CAM_TX (out), CAN_N (bidir), CAN_P (bidir), CMPS_SCL (bidir), CMPS_SDA (bidir), GPS_RX (in), GPS_TX (out), I_Sense (out), M_1 (in), M_2 (in), M_3 (in), M_4 (in), NRST (out), RADIO_RX (in), RADIO_TX (out), S1 (in), S2 (in), S3 (in), S4 (in), S5 (in), S6 (in), SWCLK (bidir), SWDIO (bidir), SWO (in), Telem (out), UART6_RX (in), UART6_TX (out), UART7_RX (in), UART7_TX (out), UART8_RX (in), UART8_TX (out), VIDEO_OUT (in), VTX_RX (in), VTX_TX (out)

### Nets
+3V3: H1.1(VCC) P6.1 P12.1 SB2.1
+5V: J13.1 J14.1 J15.1 P5.1 P11.1 SB2.3
+5VBUCK: J7.1 J8.1 J9.1 J10.1 J11.1 J12.1 SB1.1
+VBATT: J5.1 J5.9 J6.1 P4.1 P10.1 SB1.3
GND: H1.3(GND) J5.2 J5.10 J6.2 J7.2 J7.4(MNT_1) J7.5(MNT_2) J8.2 J8.4(MNT_1) J8.5(MNT_2) J9.2 J9.4(MNT_1) J9.5(MNT_2) J10.2 J10.4(MNT_1) J10.5(MNT_2) J11.2 J11.4(MNT_1) J11.5(MNT_2) J12.2 J12.4(MNT_1) J12.5(MNT_2) J13.2 J14.2 J15.2 J17.2 P1.1 P7.1 P13.1 P15.1 P17.2 P17.5
CAM_IN: J13.3 ; port CAM_IN
CAN_N: P9.1 ; port CAN_N
CAN_P: P3.1 ; port CAN_P
GPS_VIN: J17.1 SB2.2
I2C_SCL: J17.6 ; port CMPS_SCL
I2C_SDA: J17.5 ; port CMPS_SDA
I_Sense: J5.3 J6.3 ; port I_Sense  [project net ESC_CURR]
M2: J5.6 ; port M_2
M3: J5.7 ; port M_3
M4: J5.8 ; port M_4
M_1: J5.5 J6.5 ; port M_1  [project net M1]
NRST: H1.2(NRST) ; port NRST
SWCLK: H1.5(CLK) ; port SWCLK
SWDIO: H1.6(DIO) ; port SWDIO
SWO: H1.4(SWO) ; port SWO
Telem: J5.4 J6.4 ; port Telem  [project net ESC_TELEM]
TIM1_CH1: J7.3 ; port S1
TIM1_CH2: J8.3 ; port S2
TIM1_CH3: J9.3 ; port S3
TIM1_CH4: J10.3 ; port S4
TIM2_CH3: J11.3 ; port S5
TIM2_CH4: J12.3 ; port S6
UART1_RX: J14.4 ; port RADIO_TX
UART1_TX: J14.3 ; port RADIO_RX
UART2_RX: P17.3 ; port VTX_TX
UART2_TX: P17.4 ; port VTX_RX
UART3_RX: J17.4 ; port GPS_TX
UART3_TX: J17.3 ; port GPS_RX
UART5_RX: J13.5 ; port CAM_TX
UART5_TX: J13.4 ; port CAM_RX
UART6_RX: J15.4 ; port UART6_TX
UART6_TX: J15.3 ; port UART6_RX
UART7_RX: P8.1 ; port UART7_TX
UART7_TX: P2.1 ; port UART7_RX
UART8_RX: P16.1 ; port UART8_TX
UART8_TX: P14.1 ; port UART8_RX
VIDEO_OUT: P17.6 ; port VIDEO_OUT
VTX_VIN: P17.1 SB1.2

Not connected (* = marked no-connect by the designer): P17 MP1* MP2*

### Notes on the sheet
- Headers-SolderPads
- TITLE
- AUTHOR
- PROJECT
- LAST MODIFIED
- URL
- PROJECT DESCRIPTION
- REVISION
- FILE NAME
- SHEET
- OF

### Library data of the parts
H1 = CMP-002-00084-1
J5 = SM10B-SRSS-TB_LF__SN_: Connector; Manufacturer_Name: JST (JAPAN SOLDERLESS TERMINALS); Manufacturer_Part_Number: SM10B-SRSS-TB(LF)(SN); Datasheet Link: http://www.jst-mfg.com/product/pdf/eng/eSR.pdf; Mouser Part Number: 306-SM10BSRSSTBLFSN; Mouser Price/Stock: https://www.mouser.co.uk/ProductDetail/JST-Commercial/SM10B-SRSS-TBLFSN?qs=QpmGXVUTftHkZAI%2F8hE40w%3D%3D; Arrow Part Number: SM10B-SRSS-TB(LF)(SN); Arrow Price/Stock: https://www.arrow.com/en/products/sm10b-srss-tb-lf-sn/jst-manufacturing?utm_currency=USD&region=europe
J6 J13 = SM05B-GHS-TB_LF__SN_: Connector; Manufacturer_Name: JST (JAPAN SOLDERLESS TERMINALS); Manufacturer_Part_Number: SM05B-GHS-TB(LF)(SN); Datasheet Link: https://datasheet.datasheetarchive.com/originals/distributors/Datasheets_SAMA/e4ef010dc292ea31091454f6c0afb63a.pdf; Mouser Part Number: N/A; Mouser Price/Stock: https://www.mouser.co.uk/ProductDetail/JST-Commercial/SM05B-GHS-TBLFSN?qs=QpmGXVUTftEjojOT4U3d6Q%3D%3D; Arrow Part Number: SM05B-GHS-TB(LF)(SN); Arrow Price/Stock: https://www.arrow.com/en/products/sm05b-ghs-tb-lf-sn/jst-manufacturing?utm_currency=USD&region=europe
J7-J12 = CMP-002-00093-1: MCU 32-bit LPC1800 ARM Cortex M3 RISC 1024KB Flash 3.3V 100-Pin TFBGA Tray; Gender: Male; Voltage Rating: 50V; Connector Type: Male Pin, Outer Shroud Contact; Min Operating Temperature: -25°C; Mounting Technology: Surface Mount; Pins: 3; Max Operating Temperature: 85°C
J14 J15 = SM04B-GHS-TB_LF__SN_: Connector; Manufacturer_Name: JST (JAPAN SOLDERLESS TERMINALS); Manufacturer_Part_Number: SM04B-GHS-TB(LF)(SN); Datasheet Link: http://uk.rs-online.com/web/p/products/7521797; Mouser Part Number: N/A; Mouser Price/Stock: https://www.mouser.co.uk/ProductDetail/JST-Commercial/SM04B-GHS-TBLFSN?qs=QpmGXVUTftEJzKB1YHGCXw%3D%3D; Arrow Part Number: SM04B-GHS-TB(LF)(SN); Arrow Price/Stock: https://www.arrow.com/en/products/sm04b-ghs-tb-lf-sn-/jst-manufacturing?region=europe
J17 = SM06B-GHS-TB_LF__SN_: Connector; Manufacturer_Name: JST (JAPAN SOLDERLESS TERMINALS); Manufacturer_Part_Number: SM06B-GHS-TB(LF)(SN); Datasheet Link: https://datasheet.datasheetarchive.com/originals/distributors/Datasheets_SAMA/e4ef010dc292ea31091454f6c0afb63a.pdf; Mouser Part Number: N/A; Mouser Price/Stock: https://www.mouser.co.uk/ProductDetail/JST-Commercial/SM06B-GHS-TBLFSN?qs=QpmGXVUTftFzTQe43vH9Ig%3D%3D; Arrow Part Number: SM06B-GHS-TB(LF)(SN); Arrow Price/Stock: https://www.arrow.com/en/products/sm06b-ghs-tb-lf-sn/jst-manufacturing
P1-P16 = CMP-00001-1: Solder Pad 2x1.5mm, 0.5mm hole
P17 = CMP-002-00086-2: Connector Header, PH Series, 6 Position, Side Entry, 2.00mm, Solder, Surface Mount, Natural.; Gender: Male; Connector Type: Male Pin; Voltage Rating: 100V; Max Current Rating: 2A; Pins: 6; Max Operating Temperature: 85°C; Mounting Technology: Surface Mount; Min Operating Temperature: -25°C
SB1 SB2 = CMP-00030-00002-4: 3-way solder bridge mainly for power rail selection

## Sheet Sensors.SchDoc: Sensors / Peripherals
size A4; Author: Lázár Sándor; SheetNumber: 4; SheetTotal: 6; URL: lzrsystems.com
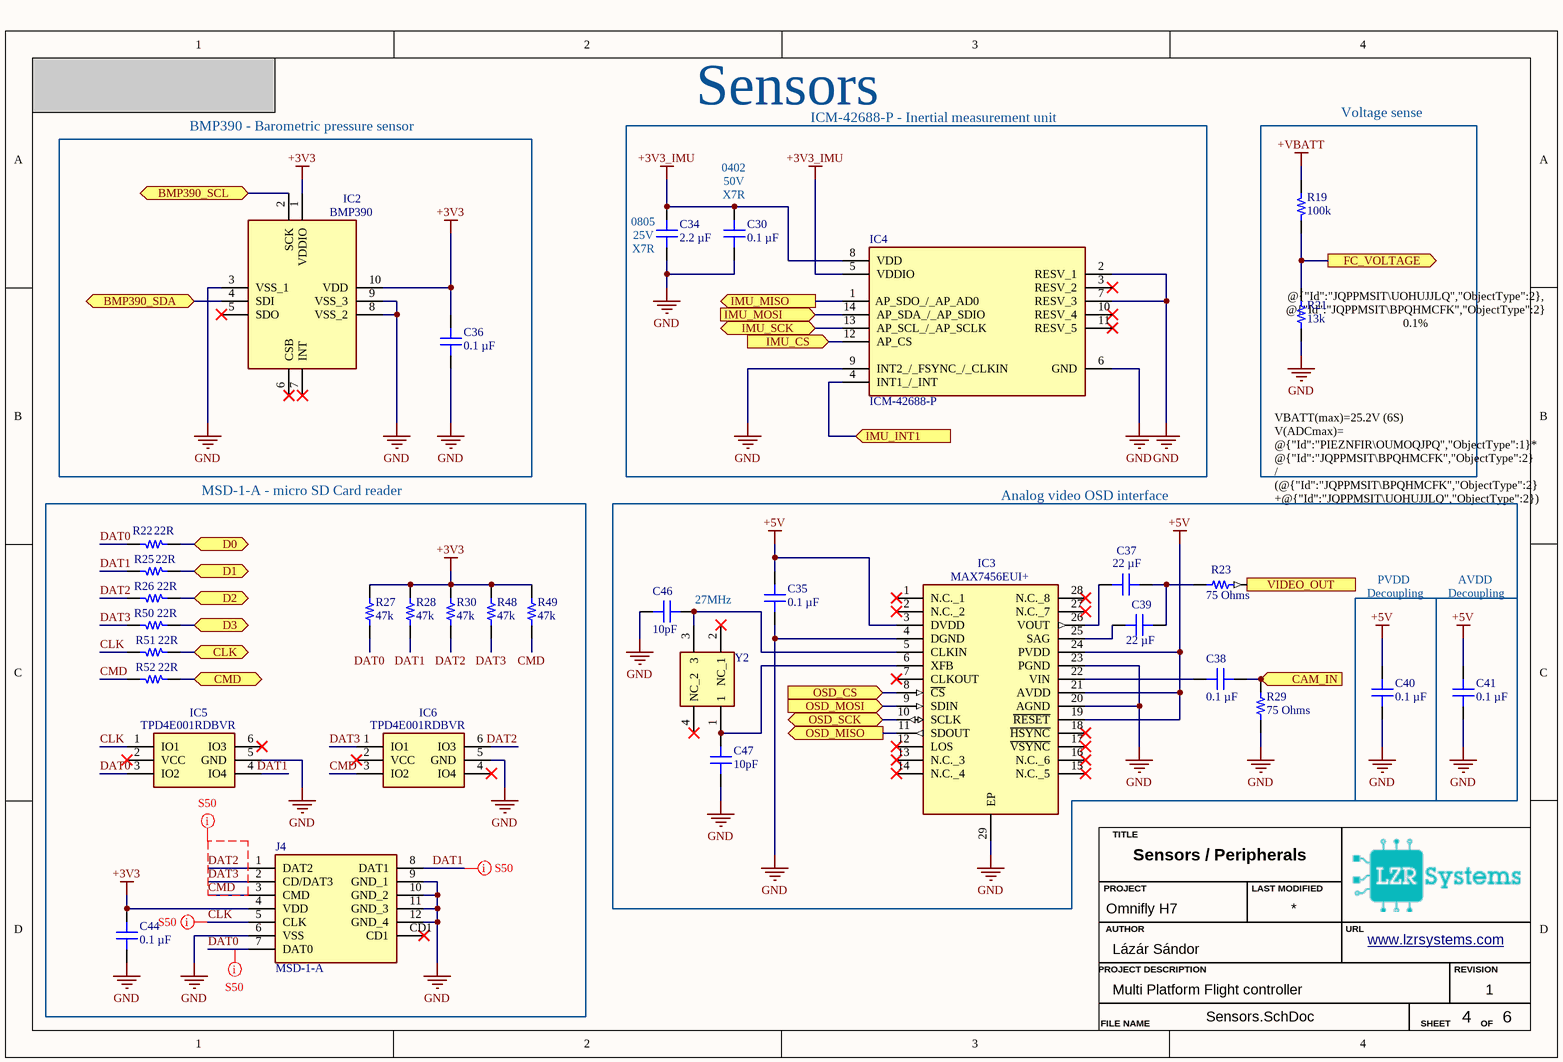
[diagram p3: Sensors.SchDoc]

### Parts
C30  0.1 µF  [MURATA GCM155 0402_1005]
C34  2.2 µF  [CAP 0805_2012]
C35  0.1 µF  [MURATA GCM155 0402_1005]
C36  0.1 µF  [MURATA GCM155 0402_1005]
C37  22 µF  [MURATA GRM21B 0805_2012]
C38  0.1 µF  [MURATA GCM155 0402_1005]
C39  22 µF  [MURATA GRM21B 0805_2012]
C40  0.1 µF  [MURATA GCM155 0402_1005]
C41  0.1 µF  [MURATA GCM155 0402_1005]
C44  0.1 µF  [MURATA GCM155 0402_1005]
C46  Capacitance: 10pF  [CAP 0402_1005]  (hidden comment: 10 pF)
C47  Capacitance: 10pF  [CAP 0402_1005]  (hidden comment: 10 pF)
IC2  BMP390  [BMP390]
IC3  MAX7456EUI+  [SOP65P638X110-29N]
IC4  ICM-42688-P  [IIM42352]
IC5  TPD4E001RDBVR  [SOT95P280X145-6N]
IC6  TPD4E001RDBVR  [SOT95P280X145-6N]
J4  MSD-1-A  [MSD1A]
R19  100k  [YAGEO RES 0402_1005]
R21  13k  [YAGEO RES 0402_1005]
R22  22R  [YAGEO RES 0402_1005]
R23  75 Ohms  [RES 0805_2012]
R25  22R  [YAGEO RES 0402_1005]
R26  22R  [YAGEO RES 0402_1005]
R27  47k  [YAGEO RES 0402_1005]
R28  47k  [YAGEO RES 0402_1005]
R29  75 Ohms  [RES 0805_2012]
R30  47k  [YAGEO RES 0402_1005]
R48  47k  [YAGEO RES 0402_1005]
R49  47k  [YAGEO RES 0402_1005]
R50  22R  [YAGEO RES 0402_1005]
R51  22R  [YAGEO RES 0402_1005]
R52  22R  [YAGEO RES 0402_1005]
Y2  XRCGB27M000FAN00R0  [XRCGB]  (value not drawn)

### Blocks framed on the sheet
BMP390 - Barometric pressure sensor: C36 IC2
ICM-42688-P - Inertial measurement unit: C30 C34 IC4
Voltage sense: R19 R21
MSD-1-A - micro SD Card reader: C44 IC5 IC6 J4 R22 R25-R28 R30 R48-R52
Analog video OSD interface: C35 C37-C41 C46 C47 IC3 R23 R29 Y2

### Ports
BMP390_SCL (bidir), BMP390_SDA (bidir), CAM_IN (in), CLK (bidir), CMD (bidir), D0 (bidir), D1 (bidir), D2 (bidir), D3 (bidir), FC_VOLTAGE (out), IMU_CS (in), IMU_INT1 (in), IMU_MISO (out), IMU_MOSI (in), IMU_SCK (bidir), OSD_CS (in), OSD_MISO (out), OSD_MOSI (in), OSD_SCK (bidir), VIDEO_OUT (out)

### Nets
+3V3: C36.2 C44.2 IC2.1(VDDIO) IC2.10(VDD) J4.4(VDD) R27.2 R28.2 R30.2 R48.2 R49.2
+3V3_IMU: C30.2 C34.2 IC4.5(VDDIO) IC4.8(VDD)
+5V: C35.2 C40.2 C41.2 IC3.3(DVDD) IC3.19(~{RESET}) IC3.21(AVDD) IC3.24(PVDD)
+VBATT: R19.2
GND: C30.1 C34.1 C35.1 C36.1 C40.1 C41.1 C44.1 C46.2 C47.2 IC2.3(VSS_1) IC2.8(VSS_2) IC2.9(VSS_3) IC3.4(DGND) IC3.20(AGND) IC3.23(PGND) IC3.29(EP) IC4.2(RESV_1) IC4.6(GND) IC4.7(RESV_3) IC4.9(INT2_/_FSYNC_/_CLKIN) IC5.5(GND) IC6.5(GND) J4.6(VSS) J4.9(GND_1) J4.10(GND_2) J4.11(GND_3) J4.12(GND_4) R21.1 R29.1
AUX_MISO: IC3.11(SDOUT) ; port OSD_MISO
AUX_MOSI: IC3.9(SDIN) ; port OSD_MOSI
AUX_SCK: IC3.10(SCLK) ; port OSD_SCK
CAM_IN: C38.1 R29.2 ; port CAM_IN
CLK: IC5.1(IO1) J4.5(CLK) R51.1
CMD: IC6.3(IO2) J4.3(CMD) R49.1 R52.1
DAT0: IC5.3(IO2) J4.7(DAT0) R22.1 R27.1
DAT1: IC5.4(IO4) J4.8(DAT1) R25.1 R28.1
DAT2: IC6.6(IO3) J4.1(DAT2) R26.1 R30.1
DAT3: IC6.1(IO1) J4.2(CD/DAT3) R48.1 R50.1
FC_VOLTAGE: R19.1 R21.2 ; port FC_VOLTAGE
I2C_SCL: IC2.2(SCK) ; port BMP390_SCL
I2C_SDA: IC2.4(SDI) ; port BMP390_SDA
IMU_CS: IC4.12(AP_CS) ; port IMU_CS
IMU_INT1: IC4.4(INT1_/_INT) ; port IMU_INT1
IMU_MISO: IC4.1(AP_SDO_/_AP_AD0) ; port IMU_MISO
IMU_MOSI: IC4.14(AP_SDA_/_AP_SDIO) ; port IMU_MOSI
IMU_SCK: IC4.13(AP_SCL_/_AP_SCLK) ; port IMU_SCK
OSD_CS: IC3.8(~{CS}) ; port OSD_CS
SDIO_CLK: R51.2 ; port CLK
SDIO_CMD: R52.2 ; port CMD
SDIO_D0: R22.2 ; port D0
SDIO_D1: R25.2 ; port D1
SDIO_D2: R26.2 ; port D2
SDIO_D3: R50.2 ; port D3
VIDEO_OUT: R23.2 ; port VIDEO_OUT
NetC37_1: C37.1 C39.1 R23.1
NetC37_2: C37.2 IC3.26(VOUT)
NetC38_2: C38.2 IC3.22(VIN)
NetC39_2: C39.2 IC3.25(SAG)
NetC46_1: C46.1 IC3.5(CLKIN) Y2.3
NetC47_1: C47.1 IC3.6(XFB) Y2.1

Not connected (* = marked no-connect by the designer): IC2 5(SDO)* 6(CSB)* 7(INT)*; IC3 1(N.C._1)* 2(N.C._2)* 7(CLKOUT)* 12(LOS)* 13(N.C._3)* 14(N.C._4)* 15(N.C._5)* 16(N.C._6)* 17(~{VSYNC})* 18(~{HSYNC})* 27(N.C._7)* 28(N.C._8)*; IC4 3(RESV_2)* 10(RESV_4)* 11(RESV_5)*; IC5 2(VCC)* 6(IO3)*; IC6 2(VCC)* 4(IO4)*; J4 CD1*; Y2 2(NC_1)* 4(NC_2)*

### Layout directives
net class S50: CLK, CMD, DAT0, DAT1, DAT2, DAT3

### Notes on the sheet
- Sensors
- (near C30) 0402
  50V
  X7R
- (near C34) 0805
  25V
  X7R
- @{"Id":"JQPPMSIT\UOHUJJLQ","ObjectType":2}, @{"Id":"JQPPMSIT\BPQHMCFK","ObjectType":2}
  0.1%
  25ppm
- VBATT(max)=25.2V (6S)
  V(ADCmax)=
  @{"Id":"PIEZNFIR\OUMOQJPQ","ObjectType":1}* @{"Id":"JQPPMSIT\BPQHMCFK","ObjectType":2} / (@{"Id":"JQPPMSIT\BPQHMCFK","ObjectType":2} +@{"Id":"JQPPMSIT\UOHUJJLQ","ObjectType":2}) =
  2.9V
- (near C46) 27MHz
- PVDD
  Decoupling
- AVDD
  Decoupling
- TITLE
- AUTHOR
- PROJECT
- LAST MODIFIED
- URL
- PROJECT DESCRIPTION
- REVISION
- FILE NAME
- SHEET
- OF

### Library data of the parts
C30 C35 C36 C38 C40 C41 C44 = GCM155R71H104ME02D: as C1 on sheet μC-Core; Part Number: GCM155R71H104ME02D; Capacitance: 0.1 µF; Applications: Automotive; componentlink1description: Datasheet; componentlink1url: https://psearch.en.murata.com/capacitor/product/GCM155R71H104ME02%23.pdf; componentlink2description: DigiKey Link; componentlink2url: https://www.digikey.com/en/products/detail/murata-electronics/GCM155R71H104ME02D/9867913; Device Package: 0402 (1005 Metric); lastupdated: 7/20/2024 2:04:19 AM; Lifecycle Status: Active; Minimum Order: 1; Mounting Type: Surface Mount, MLCC; Operating Temperature: -55°C ~ 125°C; Package / Case: 0402 (1005 Metric); packaging: TapeAndReel; partid: 39038; Part Status: Active; price: 0.01; Ratings: AEC-Q200; series: GCM; Size / Dimension: 0.039" L x 0.020" W (1.00mm x 0.50mm); Supplier 1: DigiKey; Supplier Part Number 1: 490-18204-1-ND; Temperature Coefficient: X7R; Thickness (Max): 0.022" (0.55mm); value: 0.1 µF; Voltage - Rated: 50V
C34 = GCJ21BR71E225KA01K: CAP CER; manufacturer: Murata Electronics; Temperature Coefficient: X7R; Tolerance: ±10%; Voltage - Rated: 25V; Part Number: GCJ21BR71E225KA01K; Capacitance: 2.2 µF; Applications: Automotive, Boardflex Sensitive; componentlink2description: DigiKey Link; componentlink2url: https://www.digikey.com/en/products/detail/murata-electronics/GCJ21BR71E225KA01K/10692344; Device Package: 0805 (2012 Metric); Features: Soft Termination; lastupdated: 2/9/2024 8:15:05 PM; Lifecycle Status: Active; Minimum Order: 1; Mounting Type: Surface Mount, MLCC; Operating Temperature: -55°C ~ 125°C; Package / Case: 0805 (2012 Metric); packaging: TapeAndReel; partid: 46223; Part Status: Active; price: 0.06; Ratings: AEC-Q200; series: GCJ; Size / Dimension: 0.079" L x 0.049" W (2.00mm x 1.25mm); Supplier 1: DigiKey; Supplier Part Number 1: 490-GCJ21BR71E225KA01KCT-ND; Thickness (Max): 0.057" (1.45mm); value: 2.2 µF
C37 C39 = GRM21BR61C226ME44L: CAP CER 22UF 16V X5R 0805; manufacturer: Murata Electronics; Tolerance: ±20%; Part Number: GRM21BR61C226ME44L; Capacitance: 22 µF; Applications: General Purpose; componentlink1description: Datasheet; componentlink1url: https://search.murata.co.jp/Ceramy/image/img/A01X/G101/ENG/GRM21BR61C226ME44-01.pdf; componentlink2description: DigiKey Link; componentlink2url: https://www.digikey.com/en/products/detail/murata-electronics/GRM21BR61C226ME44L/4905531; Device Package: 0805 (2012 Metric); lastupdated: 8/27/2024 9:29:55 AM; Lifecycle Status: Active; Minimum Order: 1; Mounting Type: Surface Mount, MLCC; Operating Temperature: -55°C ~ 85°C; Package / Case: 0805 (2012 Metric); packaging: TapeAndReel; partid: 16967; Part Status: Active; price: 0.06; series: GRM; Size / Dimension: 0.079" L x 0.049" W (2.00mm x 1.25mm); Supplier 1: DigiKey; Supplier Part Number 1: 490-10747-1-ND; Temperature Coefficient: X5R; Thickness (Max): 0.057" (1.45mm); value: 22 µF; Voltage - Rated: 16V
C46 C47 = C0402C100K4GAC7867: as C32 on sheet μC-Core; Part Number: C0402C100K4GAC7867; Applications: General Purpose; componentlink1description: Datasheet; componentlink1url: https://api.kemet.com/component-edge/download/datasheet/C0402C100K4GACTU.pdf; componentlink2description: DigiKey Link; componentlink2url: https://www.digikey.com/en/products/detail/kemet/C0402C100K4GAC7867/2196156; Device Package: 0402 (1005 Metric); Features: Low ESL; lastupdated: 2/9/2024 8:04:15 PM; Lifecycle Status: Active; Minimum Order: 1; Mounting Type: Surface Mount, MLCC; Operating Temperature: -55°C ~ 125°C; Package / Case: 0402 (1005 Metric); packaging: TapeAndReel; partid: 33741; Part Status: Active; price: 0.05; series: SMD Comm C0G; Size / Dimension: 0.039" L x 0.020" W (1.00mm x 0.50mm); Supplier 1: DigiKey; Supplier Part Number 1: 399-C0402C100K4GAC7867CT-ND; Thickness (Max): 0.022" (0.55mm); value: 10 pF; Voltage - Rated: 16V
IC2 = BMP390: Integrated Circuit; Manufacturer_Name: BOSCH; Datasheet Link: https://www.bosch-sensortec.com/media/boschsensortec/downloads/datasheets/bst-bmp390-ds002.pdf; Height: 0.8mm; Manufacturer_Part_Number: BMP390; Mouser Part Number: 262-BMP390; Mouser Price/Stock: https://www.mouser.co.uk/ProductDetail/Bosch-Sensortec/BMP390?qs=QNEnbhJQKvYQVfvRMgo2YA%3D%3D; Arrow Part Number: BMP390; Arrow Price/Stock: https://www.arrow.com/en/products/bmp390/bosch-sensortec?utm_currency=USD&region=nac
IC3 = MAX7456EUI+: Integrated Circuit; Manufacturer_Name: Analog Devices; Datasheet Link: http://uk.rs-online.com/web/p/products/7326970; Height: 1.1mm; Manufacturer_Part_Number: MAX7456EUI+; Mouser Part Number: 700-MAX7456EUI; Mouser Price/Stock: https://www.mouser.co.uk/ProductDetail/Analog-Devices-Maxim-Integrated/MAX7456EUI%2b?qs=1THa7WoU59EGj4X9409NRQ%3D%3D
IC4 = ICM-42688-P: Integrated Circuit; Manufacturer_Name: TDK; Datasheet Link: https://3cfeqx1hf82y3xcoull08ihx-wpengine.netdna-ssl.com/wp-content/uploads/2021/06/DS-000347-ICM-42688-P-v1.5.pdf; Manufacturer_Part_Number: ICM-42688-P; Mouser Part Number: 410-ICM-42688-P; Mouser Price/Stock: https://www.mouser.co.uk/ProductDetail/TDK-InvenSense/ICM-42688-P?qs=OlC7AqGiEDk8QrNAV728zw%3D%3D; Arrow Part Number: ICM-42688-P; Arrow Price/Stock: https://www.arrow.com/en/products/icm-42688-p/invensense?utm_currency=USD&region=nac
IC5 IC6 = TPD4E001RDBVR: Integrated Circuit; Manufacturer_Name: Texas Instruments; Datasheet Link: http://www.ti.com/lit/gpn/TPD4E001; Height: 1.45mm; Manufacturer_Part_Number: TPD4E001RDBVR; Mouser Part Number: 595-TPD4E001RDBVR; Mouser Price/Stock: https://www.mouser.co.uk/ProductDetail/Texas-Instruments/TPD4E001RDBVR?qs=P1JMDcb91o7xMbcYcXI1uw%3D%3D; Arrow Part Number: TPD4E001RDBVR; Arrow Price/Stock: https://www.arrow.com/en/products/tpd4e001rdbvr/texas-instruments?utm_currency=USD&region=nac
J4 = MSD-1-A: Connector; Manufacturer_Name: Same Sky; Datasheet Link: https://www.sameskydevices.com/product/resource/msd-1-a.pdf; Height: 2mm; Manufacturer_Part_Number: MSD-1-A; Mouser Part Number: 179-MSD-1-A; Mouser Price/Stock: https://www.mouser.co.uk/ProductDetail/Same-Sky/MSD-1-A?qs=Z%252BL2brAPG1Ip18XLC4tUPQ%3D%3D; Arrow Part Number: MSD-1-A; Arrow Price/Stock: https://www.arrow.com/en/products/msd-1-a/cui-devices?utm_currency=USD&region=nac
R19 = AA0402FR-07100KL: RES SMD 100K OHM 1% 1/16W 0402; Manufacturer: Yageo; Power (Watts): 0.063W, 1/16W; Resistance: 100 kOhms; Temperature Coefficient: ±150ppm/°C; Part Number: AA0402FR-07100KL; Value: 100k; ComponentLink1Description: Datasheet; ComponentLink1URL: https://www.yageo.com/upload/media/product/productsearch/datasheet/rchip/PYu-AA_51_RoHS_L_3.pdf; ComponentLink2Description: DigiKey Link; ComponentLink2URL: https://www.digikey.com/en/products/detail/yageo/AA0402FR-07100KL/5887718; Composition: Thick Film; Device Package: 0402 (1005 Metric); Features: Anti-Sulfur, Automotive AEC-Q200, Moisture Resistant; Height - Seated (Max): 0.015" (0.37mm); LastUpdated: 8/31/2025 3:03:39 PM; Lifecycle Status: Active; Minimum Order: 1; Number of Terminations: 2; Operating Temperature: -55°C ~ 155°C; Package / Case: 0402 (1005 Metric); Packaging: CutTape; PartId: 78675; Price: 0.01; Ratings: AEC-Q200; Series: AA; Size / Dimension: 0.039" L x 0.020" W (1.00mm x 0.50mm); Supplier 1: DigiKey; Supplier Part Number 1: 13-AA0402FR-07100KLCT-ND; Supplier Device Package: 0402; Tolerance: ±1%
R21 = AC0402FR-0713KL: RES SMD 13K OHM 1% 1/16W 0402; Manufacturer: Yageo; Power (Watts): 0.063W, 1/16W; Resistance: 13 kOhms; Temperature Coefficient: ±100ppm/°C; Part Number: AC0402FR-0713KL; Value: 13k; ComponentLink1Description: Datasheet; ComponentLink1URL: https://www.yageo.com/upload/media/product/productsearch/datasheet/rchip/PYu-AC_51_RoHS_L_8.pdf; ComponentLink2Description: DigiKey Link; ComponentLink2URL: https://www.digikey.com/en/products/detail/yageo/AC0402FR-0713KL/5895068; Composition: Thick Film; Device Package: 0402 (1005 Metric); Features: Automotive AEC-Q200, Moisture Resistant; Height - Seated (Max): 0.015" (0.37mm); LastUpdated: 8/31/2025 3:03:55 PM; Lifecycle Status: Active; Minimum Order: 1; Number of Terminations: 2; Operating Temperature: -55°C ~ 155°C; Package / Case: 0402 (1005 Metric); Packaging: CutTape; PartId: 60414; Part Status: Active; Price: 0.01; Ratings: AEC-Q200; Series: AC; Size / Dimension: 0.039" L x 0.020" W (1.00mm x 0.50mm); Supplier 1: DigiKey; Supplier Part Number 1: 13-AC0402FR-0713KLCT-ND; Supplier Device Package: 0402; Tolerance: ±1%
R22 R25 R26 R50-R52 = AC0402FR-7W22RL: RES 22 OHM 1% 1/8W 0402; Manufacturer: Yageo; Power (Watts): 0.125W, 1/8W; Resistance: 22 Ohms; Temperature Coefficient: ±100ppm/°C; Part Number: AC0402FR-7W22RL; Value: 22R; ComponentLink1Description: Datasheet; ComponentLink1URL: https://www.yageo.com/upload/media/product/productsearch/datasheet/rchip/PYu-AC_51_RoHS_L_10.pdf; ComponentLink2Description: DigiKey Link; ComponentLink2URL: https://www.digikey.com/en/products/detail/yageo/AC0402FR-7W22RL/16992800; Composition: Thick Film; Device Package: 0402 (1005 Metric); Features: Automotive AEC-Q200, Moisture Resistant; Height - Seated (Max): 0.015" (0.37mm); LastUpdated: 8/31/2025 3:03:07 PM; Lifecycle Status: Active; Minimum Order: 1; Number of Terminations: 2; Operating Temperature: -55°C ~ 155°C; Package / Case: 0402 (1005 Metric); Packaging: CutTape; PartId: 90583; Price: 0.01; Ratings: AEC-Q200; Series: AC; Size / Dimension: 0.039" L x 0.020" W (1.00mm x 0.50mm); Supplier 1: DigiKey; Supplier Part Number 1: 13-AC0402FR-7W22RLCT-ND; Supplier Device Package: 0402; Tolerance: ±1%
R23 R29 = CRG0805F75R: RES SMD 75 OHM 1% 1/8W 0805; Manufacturer: TE Connectivity Passive Product; Power (Watts): 0.125W, 1/8W; Temperature Coefficient: ±200ppm/°C; Part Number: CRG0805F75R; Value: 75 Ohms; ComponentLink1Description: Datasheet; ComponentLink1URL: https://www.te.com/commerce/DocumentDelivery/DDEController?Action=srchrtrv&DocNm=1773204&DocType=DS&DocLang=English; ComponentLink2Description: DigiKey Link; ComponentLink2URL: https://www.digikey.com/en/products/detail/te-connectivity-passive-product/CRG0805F75R/2135489; Composition: Thick Film; Device Package: 0805 (2012 Metric); Height - Seated (Max): 0.026" (0.65mm); LastUpdated: 2/8/2024 9:02:08 PM; Lifecycle Status: Active; Minimum Order: 1; Number of Terminations: 2; Operating Temperature: -55°C ~ 155°C; Package / Case: 0805 (2012 Metric); Packaging: TapeAndReel; PartId: 34689; Part Status: Active; Price: 0.01; Resistance: 75 Ohms; Series: CRG, Neohm; Size / Dimension: 0.079" L x 0.049" W (2.00mm x 1.25mm); Supplier 1: DigiKey; Supplier Part Number 1: A126386CT-ND; Supplier Device Package: 0805; Tolerance: ±1%
R27 R28 R30 R48 R49 = AC0402FR-7W47KL: RES 47K OHM 1% 1/8W 0402; Manufacturer: Yageo; Power (Watts): 0.125W, 1/8W; Resistance: 47 kOhms; Temperature Coefficient: ±100ppm/°C; Part Number: AC0402FR-7W47KL; Value: 47k; ComponentLink1Description: Datasheet; ComponentLink1URL: https://www.yageo.com/upload/media/product/productsearch/datasheet/rchip/PYu-AC_51_RoHS_L_10.pdf; ComponentLink2Description: DigiKey Link; ComponentLink2URL: https://www.digikey.com/en/products/detail/yageo/AC0402FR-7W47KL/17009967; Composition: Thick Film; Device Package: 0402 (1005 Metric); Features: Automotive AEC-Q200, Moisture Resistant; Height - Seated (Max): 0.015" (0.37mm); LastUpdated: 8/31/2025 3:03:35 PM; Lifecycle Status: Active; Minimum Order: 1; Number of Terminations: 2; Operating Temperature: -55°C ~ 155°C; Package / Case: 0402 (1005 Metric); Packaging: CutTape; PartId: 86207; Price: 0.01; Ratings: AEC-Q200; Series: AC; Size / Dimension: 0.039" L x 0.020" W (1.00mm x 0.50mm); Supplier 1: DigiKey; Supplier Part Number 1: 13-AC0402FR-7W47KLCT-ND; Supplier Device Package: 0402; Tolerance: ±1%
Y2 = XRCGB48M000F4M00R0: as Y1 on sheet μC-Core; Datasheet Link: https://www.murata.com/products/productdata/8801067466782/SPEC-XRCGB48M000F4M00R0.pdf; Height: 0.7mm; Manufacturer_Part_Number: XRCGB48M000F4M00R0; Mouser Part Number: 81-XRCGB48M000F4M0R0; Mouser Price/Stock: https://www.mouser.co.uk/ProductDetail/Murata-Electronics/XRCGB48M000F4M00R0?qs=e%252BE4OD6MgMd07skQ7eZ%2F7Q%3D%3D; Arrow Part Number: XRCGB48M000F4M00R0; Arrow Price/Stock: https://www.arrow.com/en/products/xrcgb48m000f4m00r0/murata-manufacturing